# EAGLE design Explore Labs ESP8266 WiFi Internet of Things IoT Breakout (EAGLE 7.5.0)
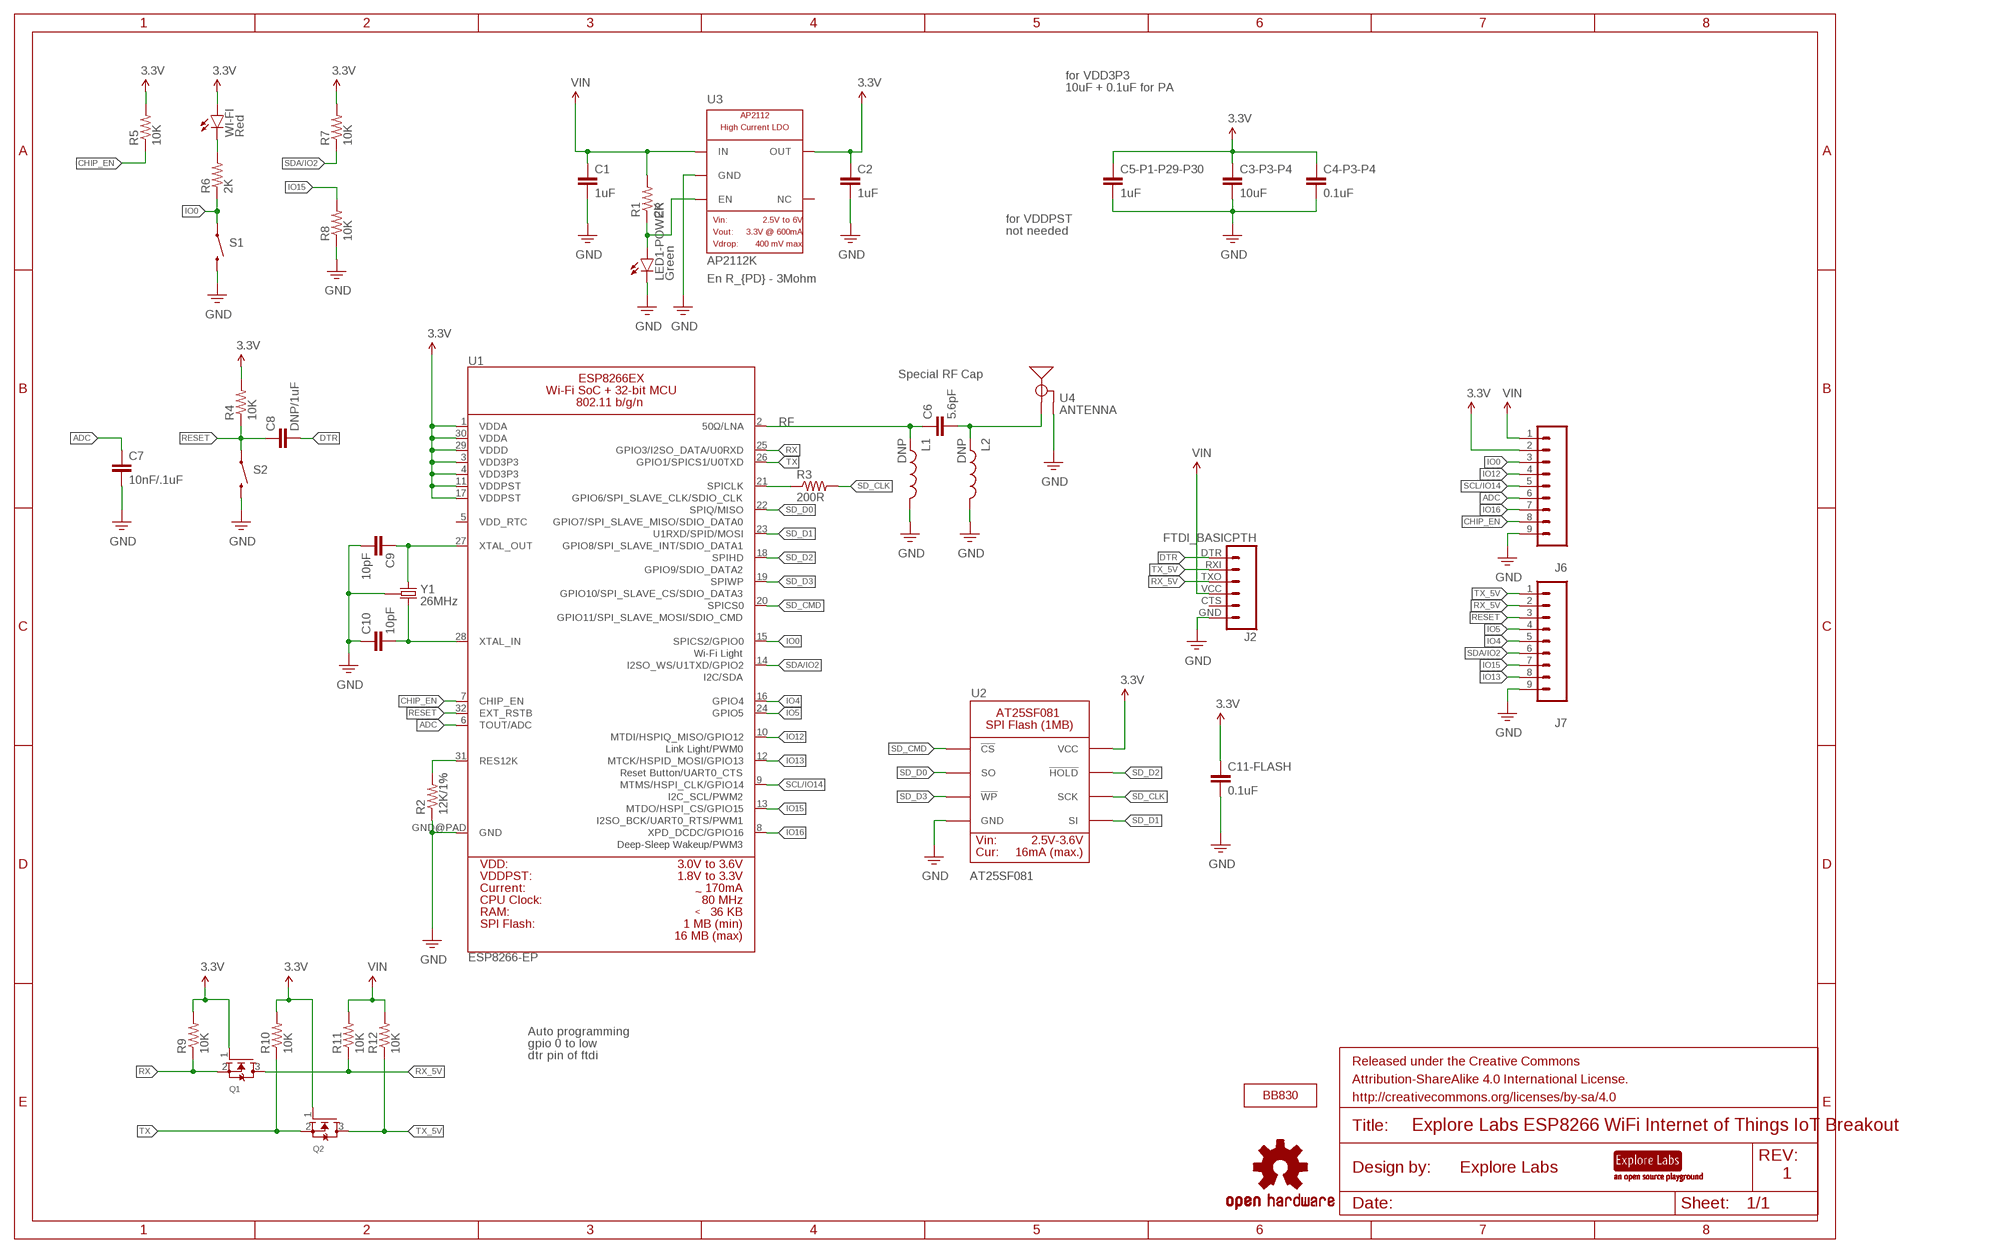
[diagram p0: schematic, sheet 1]

## Parts
C1  1uF  CAPACITOR-0402  [0402-CAP]
C2  1uF  CAPACITOR-0402  [0402-CAP]
C3-P3-P4  10uF  CAPACITOR  [0603-CAP]
C4-P3-P4  0.1uF  CAPACITOR-0402  [0402-CAP]
C5-P1-P29-P30  1uF  CAPACITOR-0402  [0402-CAP]
C6  5.6pF  CAPACITOR-0402  [0402-CAP]
C7  10nF/.1uF  CAPACITOR-0402  [0402-CAP]
C8  DNP/1uF  CAPACITOR-0402  [0402-CAP]
C9  10pF  CAPACITOR-0402  [0402-CAP]
C10  10pF  CAPACITOR-0402  [0402-CAP]
C11-FLASH  0.1uF  CAPACITOR-0402  [0402-CAP]
J2  FTDI_BASICPTH  [FTDI_BASIC]
J6  M09  [1X09]
J7  M09  [1X09]
L1  DNP  INDUCTOR  [0402-FERRITE]
L2  DNP  INDUCTOR  [0402-FERRITE]
LED1-POWER  Green  LED0603  [LED-0603]
LOGO1  OSHW-LOGOBOTTOM  [OSHW-LOGO-M-BOTTOM]
Q1  MOSFET-N  [SOT23]
Q2  MOSFET-N  [SOT23]
R1  2K  RESISTOR-0402  [0402-RES]
R2  12K/1%  RESISTOR-0402  [0402-RES]
R3  200R  RESISTOR-0402  [0402-RES]
R4  10K  RESISTOR-0402  [0402-RES]
R5  10K  RESISTOR-0402  [0402-RES]
R6  2K  RESISTOR-0402  [0402-RES]
R7  10K  RESISTOR-0402  [0402-RES]
R8  10K  RESISTOR-0402  [0402-RES]
R9  10K  RESISTOR-0402  [0402-RES]
R10  10K  RESISTOR-0402  [0402-RES]
R11  10K  RESISTOR-0402  [0402-RES]
R12  10K  RESISTOR-0402  [0402-RES]
S1  SWITCH-NO-MOM  [KXT-SWITCH]
S2  SWITCH-NO-MOM  [KXT-SWITCH]
U1  ESP8266-EP  [QFN32]
U2  AT25SF081  [SO08]
U3  AP2112K  [SOT23-LDO]
U4  ANTENNA  [ANTENNA-WROOM-02-INV]
U$3  26MHz  CRYSTAL-GROUNDED  [CRYSTAL-3225]
U$4  EXPLORE-LABS-LOGOBOTTOM  [EXLABS_LOGO_0.25]
U$7  BREADBOARD-830  [BREADBOARD-830]
WI-FI  Red  LED0603  [LED-0603]

## Nets
3.3V: C2.1 C3-P3-P4.1 C4-P3-P4.1 C5-P1-P29-P30.1 C11-FLASH.1 J6.2 Q1.1(G) Q2.1(G) R4.2 R5.2 R7.2 R9.2 R10.2 U1.1(VDDA) U1.3(VDD3P3) U1.4(VDD3P3) U1.11(VDDPST) U1.17(VDDPST) U1.29(VDDD) U1.30(VDDA) U2.8(VCC) U3.5(OUT) WI-FI.A
ADC: C7.1 J6.6 U1.6(TOUT/ADC)
CHIP_EN: J6.8 R5.1 U1.7(CHIP_EN)
DTR: C8.2 J2.DTR
GND: C1.2 C2.2 C3-P3-P4.2 C4-P3-P4.2 C5-P1-P29-P30.2 C7.2 C9.2 C10.1 C11-FLASH.2 J2.GND J6.9 J7.9 L1.2 L2.2 LED1-POWER.C R2.1 R8.1 S1.2 S2.2 U1.GND@PAD(GND) U2.4(GND) U3.2(GND) U4.GND U$3.2 U$3.4
IO0: J6.3 R6.1 S1.1 U1.15(SPICS2/GPIO0)
IO4: J7.5 U1.16(GPIO4)
IO5: J7.4 U1.24(GPIO5)
IO12: J6.4 U1.10(MTDI/HSPIQ_MISO/GPIO12)
IO13: J7.8 U1.12(MTCK/HSPID_MOSI/GPIO13)
IO15: J7.7 R8.2 U1.13(MTDO/HSPI_CS/GPIO15)
IO16: J6.7 U1.8(XPD_DCDC/GPIO16)
N$1: R3.1 U1.21(SPICLK)
N$2: R6.2 WI-FI.C
N$3: LED1-POWER.A R1.1 U3.3(EN)
N$6: C9.1 U1.27(XTAL_OUT) U$3.1
N$8: C10.2 U1.28(XTAL_IN) U$3.3
N$11: R2.2 U1.31(RES12K)
N$13: C6.2 L2.1 U4.SIG(SIGNAL)
RESET: C8.1 J7.3 R4.1 S2.1 U1.32(EXT_RSTB)
RF: C6.1 L1.1 U1.2(50Ω/LNA)
RX: Q1.2(S) R9.1 U1.25(GPIO3/I2SO_DATA/U0RXD)
RX_5V: J2.TXO J7.2 Q1.3(D) R11.1
SCL/IO14: J6.5 U1.9(MTMS/HSPI_CLK/GPIO14)
SD_CLK: R3.2 U2.6(SCK)
SD_CMD: U1.20(SPICS0) U2.1(!CS)
SD_D0: U1.22(SPIQ/MISO) U2.2(SO)
SD_D1: U1.23(U1RXD/SPID/MOSI) U2.5(SI)
SD_D2: U1.18(SPIHD) U2.7(!HOLD)
SD_D3: U1.19(SPIWP) U2.3(!WP)
SDA/IO2: J7.6 R7.1 U1.14(I2SO_WS/U1TXD/GPIO2)
TX: Q2.2(S) R10.1 U1.26(GPIO1/SPICS1/U0TXD)
TX_5V: J2.RXI J7.1 Q2.3(D) R12.1
VIN: C1.1 J2.VCC J6.1 R1.2 R11.2 R12.2 U3.1(IN)
Unconnected: J2.CTS U1.5(VDD_RTC) U3.4(NC)

## Notes on the sheet
- for VDD3P3
- 10uF + 0.1uF for PA
- for VDDPST
- not needed
- En R_{PD} - 3Mohm
- Special RF Cap
- Y1
- Auto programming
- gpio 0 to low
- dtr pin of ftdi
- 1

## Library data of the parts
C1 C2 C3-P3-P4 C4-P3-P4 C5-P1-P29-P30 C6-C10 C11-FLASH = Explore Labs EAGLE Library:CAPACITOR
J2 = SparkFun-Connectors:FTDI_BASIC: FTDI Basic header with labels
J6 J7 = SparkFun-Connectors:M09: Header 9 Standard 9-pin 0.1" header. Use with straight break away headers (SKU : PRT-00116), right angle break away headers (PRT-00553), swiss pins (PRT-00743), machine pins (PRT-00117), and female headers (PRT-00115).
L1 L2 = Explore Labs EAGLE Library:INDUCTOR: Inductors Basic Inductor/Choke - 0603 and 1206. Footprints are not proven and vary greatly between part numbers.
LED1-POWER WI-FI = SparkFun-LED:LED: LEDs Standard schematic elements and footprints for 5mm, 3mm, 1206, and 0603 sized LEDs. 5mm - Spark Fun Electronics SKU : COM-00529 (and others)
LOGO1 = Explore Labs EAGLE Library:OSHW-LOGO: Open Source Hardware Logo This logo indicates the piece of hardware it is found on incorporates a OSHW license and/or adheres to the definition of open source hardware found here: http://freedomdefined.org/OSHW
Q1 Q2 = Explore Labs EAGLE Library:MOSFET-N: 2N7002P 60 V, 360 mA N-channel Trench MOSFET. N-channel enhancement mode Field-Effect Transistor (FET) in a small SOT23 (TO-236AB) Surface-Mounted Device (SMD) plastic package using Trench MOSFET technology. VDS (drain-source voltage) = 60 V (max.) VGS (gate-source voltage) = -20 V to 20 V ID (drain current) = 360 mA RDSon (drain-source on-state resistance) = 1.6 ohm (max.) VGSth (gate-source threshold voltage) = 1.1 V (min.), 1.75 V (typ.), 2.4 V (max.)
R1-R12 = Explore Labs EAGLE Library:RESISTOR
S1 S2 = Explore Labs EAGLE Library:SWITCH-NO-MOM: Normally Open switches - Pushbuttons (for reset), etc.
U1 = Explore Labs EAGLE Library:ESP8266: ESP8266EX Datasheet Version 4.4 Espressif Systems IOT Team http://bbs.espressif.com/ ESP8266EX offers a complete and self-contained WiFi networking solution; it can be used to host the application or to offload WiFi networking functions from another application processor. When ESP8266EX hosts the application, it boots up directly from an external flash. In has integrated cache to improve the performance of the system in such applications. Alternately, serving as a WiFi adapter, wireless internet access can be added to any micro controller- based design with simple connectivity (SPI/SDIO or I2C/UART interface). ESP8266EX also integrates an enhanced version of Tensilica’s L106 Diamond series 32-bit processor, with on-chip SRAM, besides the WiFi functionalities. Features: 802.11 b/g/n Integrated low power 32-bit MCU Integrated 10-bit ADC Integrated TCP/IP protocol stack Integrated TR switch, balun, LNA, power amplifier and matching network Integrated PLL, regulators, and power management units Supports antenna diversity WiFi 2.4 GHz, support WPA/WPA2 Deep sleep power < 10uA, Power down leakage current < 5uA Wake up and transmit packets in < 2ms Standby power consumption of < 1.0mW (DTIM3)
U2 = Explore Labs EAGLE Library:AT25SF081: AT25SF081 8-Mbit, 2.5V Minimum SPI Serial Flash Memory with Dual-I/O and Quad-IO Support Features: Single 2.5V - 3.6V Supply Serial Peripheral Interface (SPI) Compatible Supports SPI Modes 0 and 3 Supports Dual and Quad Output Read 104MHz Maximum Operating Frequency Low Power Dissipation: 2μA Deep Power-Down Current (Typical) 10μA Standby current (Typical) 4mA Active Read Current (Typical)
U3 = Explore Labs EAGLE Library:AP2112K
U4 = Explore Labs EAGLE Library:ANTENNA: 2.4 GHz Inverted F Antenna as shown in Design Note DN0007 (swru120b) by Audun Andersen of Texas Instruments. The antenna has an omni directional radiation pattern in the plane of the PCB. Summary of the Properties of the IFA: Gain in XY Plane: 1.1 dB Gain in XZ Plane: 3.3 dB Gain in YZ Plane: 1.6 dB Reflection: < -15 dB Antenna Size: 25.7 x 7.5 mm Note: No external matching components are needed since the impedance of the Inverted F Antenna is matched directly to 50 ohm. Note: PCB with 1 mm thickness is taken as reference width in design note. Note: Width of Feed Point: 0.46 mm.
U$3 = Explore Labs EAGLE Library:CRYSTAL-GROUNDED
U$4 = Explore Labs EAGLE Library:EXPLORE-LABS-LOGO
U$7 = Explore Labs EAGLE Library:BREADBOARD-830

## Board
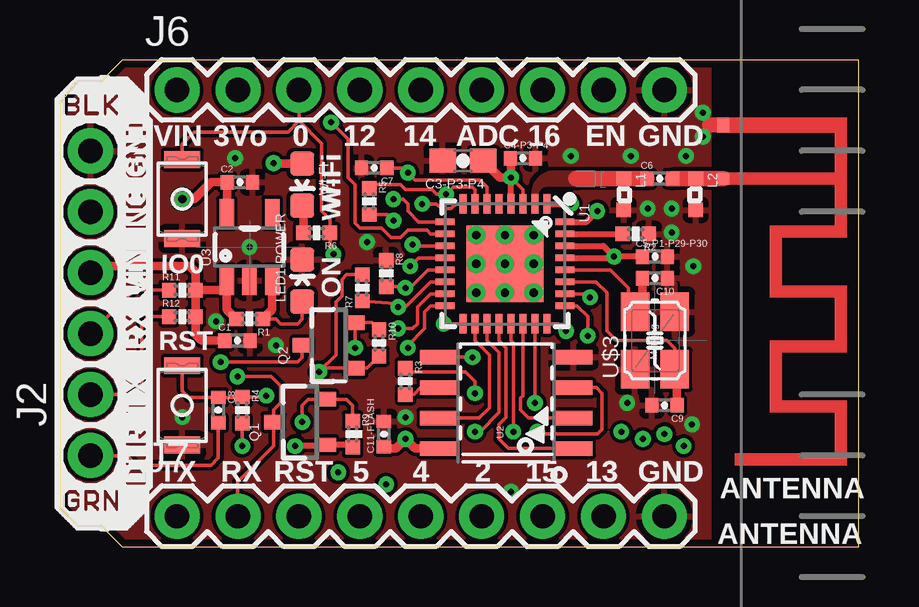
[diagram p1: board, top side]
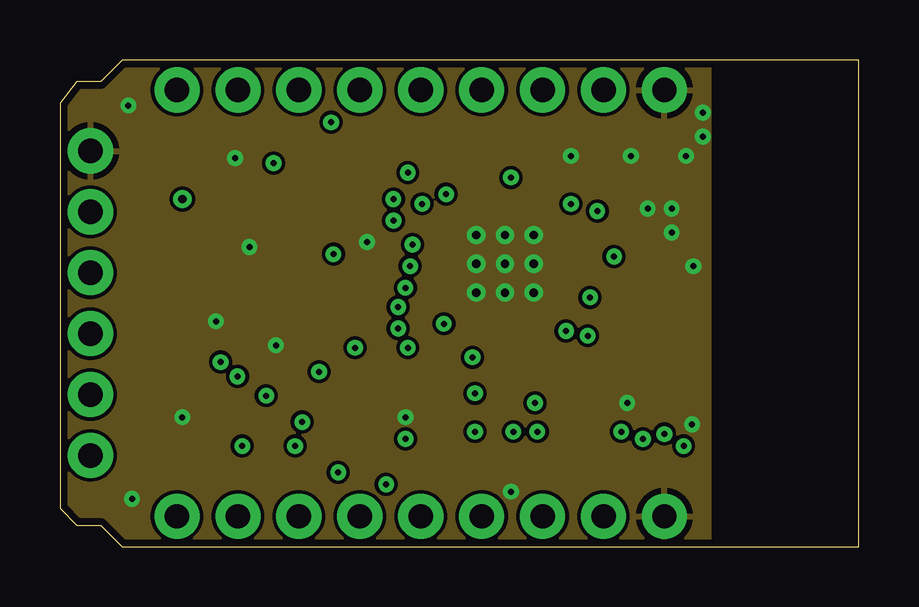
[diagram p2: board, inner layer Route2]
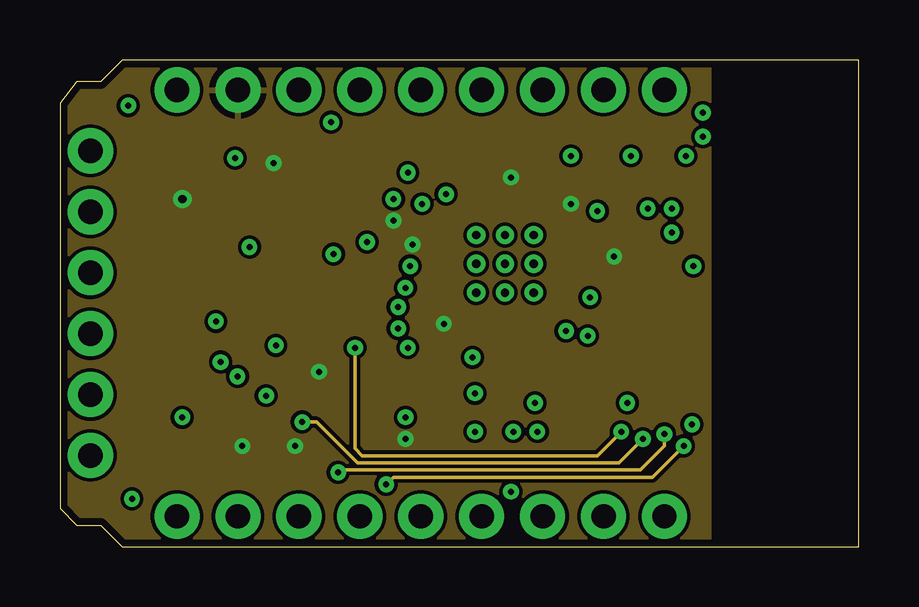
[diagram p3: board, inner layer Route15]
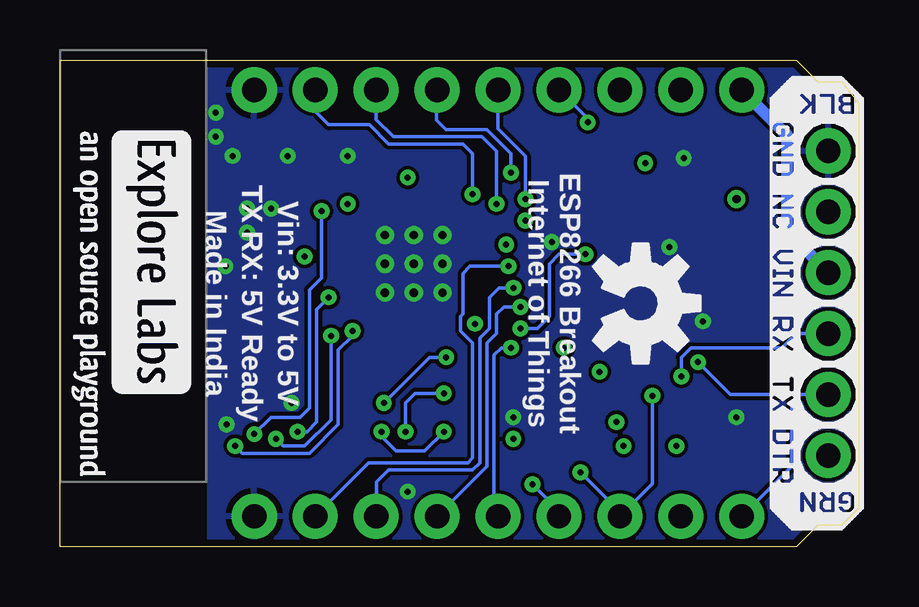
[diagram p4: board, bottom side, seen from below]

Size 33.3 x 20.3 mm. Coordinates in mm from the lower left corner, seen from the top.
Outline: 2.6,0 33.3,0 33.3,20.3 2.6,20.3 1.7,19.4 0.7,19.4 0,18.5 0,1.6 0.7,0.9 1.7,0.9 2.6,0
Copper layers (1+2*15+16): Top 0.035mm / dielectric 0.35mm / Route2 0.035mm / dielectric 0.71mm / Route15 0.035mm / dielectric 0.35mm / Bottom 0.035mm
Design rules "Explore Labs 4 Layer - Standard Stack-Up *": minimum track width 0.15mm, minimum drill 0.15mm, track to track 0.15mm, track to pad 0.15mm, pad to pad 0.15mm, via to via 0.15mm, smd to smd 0.15mm, copper to edge 0.3mm, drill to drill 0.2mm, minimum pad ring 10mil, minimum via ring 8mil, stop-mask expansion 4mil, vias tented up to drill 0.35mm, thermal gap 10mil

### Footprints (pad centres in the part's own frame; a part is rotated, then mirrored left to right if it is on the bottom)
0402-CAP = smd 0.55 x 0.6: 1 -0.525,0; 2 0.525,0
0603-CAP = smd 1.1 x 1: 1 -0.85,0; 2 0.85,0
FTDI_BASIC = drill 1.016 pad 1.88: CTS 10.16,0; DTR 0,0; GND 12.7,0; RXI 2.54,0; TXO 5.08,0; VCC 7.62,0
1X09 = drill 1.016 pad 1.88: 1 0,0; 2 2.54,0; 3 5.08,0; 4 7.62,0; 5 10.16,0; 6 12.7,0; 7 15.24,0; 8 17.78,0; 9 20.32,0
0402-FERRITE = smd 0.6 x 0.6: 1 -0.65,0; 2 0.65,0
LED-0603 = smd 1 x 1: A 0,-0.877; C 0,0.877
SOT23 = smd 0.6 x 0.8: 1 -0.95,-1; 2 0.95,-1; 3 0,1.2
0402-RES = smd 0.6 x 0.6: 1 -0.55,0; 2 0.55,0
KXT-SWITCH = smd 0.7 x 1.5: 1 -1.65,0; 2 1.65,0
QFN32 = smd 0.8 x 0.285: 1 -2.5,1.75; 2 -2.5,1.25; 3 -2.5,0.75; 4 -2.5,0.25; 5 -2.5,-0.25; 6 -2.5,-0.75; 7 -2.5,-1.25; 8 -2.5,-1.75; 17 2.5,-1.75; 18 2.5,-1.25; 19 2.5,-0.75; 20 2.5,-0.25; 21 2.5,0.25; 22 2.5,0.75; 23 2.5,1.25; 24 2.5,1.75 | smd 0.285 x 0.8: 9 -1.75,-2.5; 10 -1.25,-2.5; 11 -0.75,-2.5; 12 -0.25,-2.5; 13 0.25,-2.5; 14 0.75,-2.5; 15 1.25,-2.5; 16 1.75,-2.5; 25 1.75,2.5; 26 1.25,2.5; 27 0.75,2.5; 28 0.25,2.5; 29 -0.25,2.5; 30 -0.75,2.5; 31 -1.25,2.5; 32 -1.75,2.5 | smd 3.2 x 3.2: GND@PAD 0,0
SO08 = smd 0.6 x 1.6: 1 -1.905,-2.8; 2 -0.635,-2.8; 3 0.635,-2.8; 4 1.905,-2.8; 5 1.905,2.8; 6 0.635,2.8; 7 -0.635,2.8; 8 -1.905,2.8
SOT23-LDO = smd 1.2 x 0.6: 1 -1.4,0.95; 2 -1.4,0; 3 -1.4,-0.95; 4 1.4,-0.95; 5 1.4,0.95
ANTENNA-WROOM-02-INV = smd 0.627 x 0.5: GND -1.986,0.25 | smd 0.5 x 0.5: SIG 0.25,0.25
CRYSTAL-3225 = smd 1.6 x 1.2: 1 -1.2,-0.825; 2 1.2,-0.825; 3 1.2,0.825; 4 -1.2,0.825

### Placement (x,y rotation side)
C1  7.4,8.6 0 top
C2  7.5,15.2 0 top
C3-P3-P4  16.8,16.1 180 top
C4-P3-P4  19.3,16.2 0 top
C5-P1-P29-P30  24.8,12.1 0 top
C6  25,15.35 0 top
C7  13.1,15.8 180 top
C8  6.6,5.7 270 top
C9  25.2,5.9 180 top
C10  24.8,11.2 180 top
C11-FLASH  13.5,4.7 90 top
J2  1.27,3.81 90 top
J6  4.88,19.05 0 top
J7  4.88,1.27 0 top
L1  23.5,14.7 270 top
L2  26.5,14.7 270 top
LED1-POWER  10.1,11.1 0 top
LOGO1  9.1,10.15 90 top
Q1  10.1,5.2 90 top
Q2  11.3,8.4 90 top
R1  7.9,9.5 180 top
R2  24,13.05 180 top
R3  14.4,6.9 270 top
R4  7.6,5.7 270 top
R5  12.9,14.4 270 top
R6  10.7,13.1 180 top
R7  12.6,10.8 90 top
R8  13.6,11.4 270 top
R9  12.2,4.7 270 top
R10  13.3,8.5 270 top
R11  5.1,10.7 0 top
R12  5.1,9.6 0 top
S1  5.1,14.5 270 top
S2  5.1,5.9 270 top
U1  18.55,11.8 270 top
U2  18.6,6 90 top
U3  7.9,12.5 90 top
U4  27.4,15.6 270 top
U$1  [ESP-FTDI-BOTTOM]  1.3,10.2 0 top
U$2  [ESP-FTDI]  1.3,10.1 0 top
U$3  24.8,8.6 90 top
U$4  32.9,17.35 270 bottom
U$7  28.38,37.47 180 top  (outside the outline)
WI-FI  10.1,15.1 180 top

### Tracks (layer width: path | path; a pad name or v marks a point on that pad's centre or on a via)
3.3V  (via drill 0.25, 0.35)
  Top 0.15: U1.3 19.3,14.9 v18.8,15.4 | U1.11 14.75,12.55 v14.7,12.6 | U1.17 v16,9.3 | v13.9,13.6 13.65,13.85 R5.2 | R10.2 12.8,7.45 Q2.1 10.95,7.45 v10.8,7.3 11.5,8 11.5,10.2 11.75,10.45 11.75,11.15 11.95,11.35 R7.2 | R4.2 7.6,4.4 v7.6,4.2
  Top 0.25: U1.1 v21.3,14.3 | C5-P1-P29-P30.1 v23.1,12.1 | U1.30 22.65,12.55 v23.1,12.1 | U1.29 23.05,12.05 v23.1,12.1 | U1.4 v18.8,15.4 | R5.2 | 11.2,4.15 11.15,4.2 v9.8,4.2 | R9.2 12.1,4.25 Q1.1
  Top 0.35: 13.45,4.1 14,4.1 v14.4,4.5 14.81,4.09 U2.8 | 13.45,4.1 C11-FLASH.1 | C3-P3-P4.1 18.35,15.4 v18.8,15.4 18.8,16.17 C4-P3-P4.1 | WI-FI.A 9.03,15.98 v8.9,16 | 13.45,4.1 13.4,4.15 | 11.2,4.15 Q1.1 | U3.5 6.97,13.93 C2.1 6.3,15.2 5.6,14.5 v5.1,14.5
  pour Route15: -1.2,25.8 27.1,25.8 27.1,-0.2 -1.2,-0.2
ADC  (via drill 0.25)
  Top 0.15: U1.6 17.8,15 17.5,15.3 14.8,15.3 v14.5,15.6 14.3,15.8 C7.1
  Bottom 0.15: v14.5,15.6 14.5,16.4 15.5,17.4 17.2,17.4 17.6,17.8 17.6,19.03 J6.6
CHIP_EN  (via drill 0.25)
  Top 0.15: U1.7 17.3,14.9 17.2,15 16.4,15 v16.1,14.7 15.7,14.7 15.5,14.9 14.4,14.9 14.2,15.1 13.05,15.1 R5.1
  Bottom 0.15: v16.1,14.7 16.1,16.4 16.5,16.8 19.6,16.8 20.4,17.6 22.1,17.6 22.66,18.16 J6.8
DTR
  Top 0.15: C8.2 6.6,3.7 6.3,3.4 3.2,3.4 2.8,3.8 J2.DTR
GND  (via drill 0.25, 0.35)
  Top 0.627: U4.GND 27.09,17.59
  other vias: 21.3,16.3 26.4,11.7 24.5,14.1 18.8,2.3 14.4,5.4 26.1,16.3 23.8,16.3 23.65,6 26.35,5.1 2.85,18.4 25.5,14.1 25.5,13.1 26.8,18.1 26.8,17.1 7.9,12.5 17.35,13 19.75,13 18.55,11.8 19.75,10.6 17.35,10.6 19.75,11.8 17.35,11.8 18.55,13 18.55,10.6 9,8.4 12.8,12.7 7.3,16.2 3,2 5.1,5.4 6.5,9.4
  pour Top (rank 3): -1.2,29.8 27.1,29.8 27.1,-0.2 -1.2,-0.2
  pour Bottom: -1.2,23.8 27.1,23.8 27.1,-0.2 -1.2,-0.2
  pour Route2: -1.2,27.8 27.1,27.8 27.1,-0.2 -1.2,-0.2
IO0  (via drill 0.25)
  Top 0.15: U1.15 15.45,10.55 14.9,10 14.9,9.3 14.7,9.1 v14.1,9.1 | J6.3 9.96,17.76 | 9.96,17.76 9.5,17.3 5.6,17.3 5.1,16.8 S1.1 | 9.96,17.76 10.9,16.82 10.9,14 11.25,13.65 R6.1 11.25,12.35 v11.4,12.2
  Bottom 0.15: v14.1,9.1 13.4,9.1 12.9,9.6 12.9,11.8 12.5,12.2 v11.4,12.2
IO4  (via drill 0.25)
  Top 0.15: U1.16 15.45,10.05 15.2,9.8 15.2,9.1 14.5,8.4 v14.5,8.3
  Bottom 0.15: v14.5,8.3 14.9,8.3 15.2,8 15.2,1.43 J7.5
IO5  (via drill 0.25)
  Top 0.15: U1.24 20.8,9.3 v21.1,9
  Route15 0.15: v13.6,2.6 13.9,2.9 24.7,2.9 v26,4.2
  Bottom 0.15: v21.1,9 21.1,8.8 21.7,8.2 21.7,5.1 22.9,3.9 25.7,3.9 v26,4.2 | v13.6,2.6 12.5,1.5 J7.4
IO12  (via drill 0.25)
  Top 0.15: U1.10 15.45,13.05 15.3,13.2 14.5,13.2 14.2,12.9 13.8,12.9 13.4,13.3 12.5,13.3 12.3,13.5 12.3,15.1 12,15.4 12,17 v11.3,17.7
  Bottom 0.15: J6.4 11.3,17.85 v11.3,17.7
IO13  (via drill 0.25)
  Top 0.15: U1.12 14.95,12.05 v14.6,11.7
  Bottom 0.15: v14.6,11.7 16.2,11.7 16.5,11.4 16.5,9.7 16.6,9.6 16.6,9 16.1,8.5 16.1,3.7 16.3,3.5 20.43,3.5 J7.8
IO15  (via drill 0.25)
  Top 0.15: U1.13 15.35,11.55 14.6,10.8 v14.4,10.8 14.35,10.85 R8.2
  Bottom 0.15: v14.4,10.8 15,10.8 15.4,10.4 15.4,9.1 15.8,8.7 15.8,3.5 16.1,3.2 19.6,3.2 20.1,2.7 20.1,1.39 20.12,1.37 J7.7
IO16  (via drill 0.25)
  Top 0.15: U1.8 16.5,14.3 16.3,14.1 15.9,14.1 15.7,14.3 v15.1,14.3
  Bottom 0.15: v15.1,14.3 15.1,16.5 15.7,17.1 19.4,17.1 20.12,17.82 J6.7
N$1  (via drill 0.25)
  Top 0.15: U1.21 18.8,8.6 18.9,8.5 v18.9,4.8 | R3.1 14.55,7.3 16.9,7.3 17.3,6.9 v17.3,6.4
  Bottom 0.15: v17.3,6.4 18.5,6.4 18.9,6 v18.9,4.8
N$2
  Top 0.35: WI-FI.C 10.15,14.17 R6.2
N$3
  Top 0.15: R1.1 9,9.5 9.2,9.3 9.9,9.3 10.1,9.5 LED1-POWER.A
  Top 0.35: U3.3 8.85,9.9 R1.1
N$6
  Top 0.15: U1.27 22.35,11.05 22.8,10.6 22.8,9 23.2,8.6 25.3,8.6 25.62,8.28 U$3.1 | 25.65,7.37 U$3.1 | 25.6,7.42 U$3.1
  Top 0.25: 25.73,7.3 U$3.1
  Top 0.35: C9.1 25.73,7.3 U$3.1
  Top 0.5: 25.75,7.27 U$3.1
N$8
  Top 0.15: U1.28 22.95,11.55 23.7,10.8 23.7,10.07 U$3.3 23.7,10.07
  Top 0.25: 24.28,10.11 U$3.3
  Top 0.35: C10.2 24.28,10.1 U$3.3
N$11
  Top 0.25: U1.31 R2.2
N$13
  Top 0.65: U4.SIG L2.1 C6.2
RESET  (via drill 0.25)
  Top 0.15: S2.1 5.1,6.5 5.38,6.22 C8.1 7.58,6.22 R4.1 8.55,6.25 v8.6,6.3
  Top 0.25: U1.32 21.95,13.55 v22.4,14
  Route15 0.15: v25.2,4.7 25.2,4.2 24.2,3.2 11.8,3.2 11.7,3.1 v11.6,3.1
  Bottom 0.15: v22.4,14 22.4,11.2 22.9,10.7 22.9,5.8 23.3,5.4 24.5,5.4 v25.2,4.7 | v8.6,6.3 8.6,2.63 J7.3 9.96,1.46 v11.6,3.1
RF
  Top 0.65: 21.5,15.35 L1.1 C6.1
  pour Top (rank 2, no thermals): 19.66,14.7 arc-83 20.44,15.68 21.5,15.68 21.5,15.03 20.38,15.03 arc82 19.95,14.7
RX  (via drill 0.25)
  Top 0.15: U1.25 21.55,10.05 22,9.6 v22,8.8 | R9.1 12.2,5.9 11.95,6.15 Q1.2 10.35,6.15 10.1,5.9 v10.1,5.2
  Route15 0.15: v24.3,4.5 23.3,3.5 12.4,3.5 10.7,5.2 v10.1,5.2
  Bottom 0.15: v22,8.8 22,5.3 23.1,4.2 24,4.2 v24.3,4.5
RX_5V  (via drill 0.25)
  Top 0.15: R11.1 3.08,10.7 J2.TXO | Q1.3 | Q1.3 8.9,4.2 7.4,2.7 7.4,1.29 J7.2 | Q1.3 8.9,5.7 9.2,6 9.2,6.7 8.8,7.1 v7.4,7.1
  Bottom 0.15: J2.TXO 2.61,8.89 3.2,8.3 7,8.3 7.4,7.9 v7.4,7.1
SCL/IO14  (via drill 0.25)
  Top 0.15: v13.9,14.5 14.3,14.5 14.5,14.3 14.5,14 14.95,13.55 U1.9
  Bottom 0.15: v13.9,14.5 13.9,16.3 15.04,17.44 J6.5
SD_CLK
  Top 0.15: R3.2 14.75,6.35 15.04,6.63 U2.6
SD_CMD
  Top 0.15: U1.20 18.3,8.6 18.6,8.3 18.6,5.4 18.3,5.1 18.3,4.5 18.7,4.1 20.8,4.1 | 20.8,4.1 21.26,4.1 | U2.1 20.8,4.09 20.8,4.1
SD_D0
  Top 0.15: U1.22 19.3,6.3 19.2,6.2 19.2,5.7 19.54,5.37 U2.2
SD_D1  (via drill 0.25)
  Top 0.15: U1.23 19.8,8.5 19.8,6.7 19.8,6.4 v19.8,6 | U2.5 17.3,7.91 v17.2,7.9
  Bottom 0.15: v19.8,6 17.9,7.9 v17.2,7.9
SD_D2
  Top 0.15: U1.18 17.3,8.6 17.9,8 17.9,5.8 17.46,5.37 U2.7
SD_D3  (via drill 0.25)
  Top 0.15: U1.19 17.8,8.6 18.3,8.1 18.3,5.6 17.5,4.8 v17.3,4.8 | v19.9,4.8 20,4.7 22.4,4.7 22.6,4.9 22.6,6.4 22.36,6.63 U2.3
  Bottom 0.15: v17.3,4.8 18.1,4 19.3,4 19.9,4.6 v19.9,4.8
SDA/IO2  (via drill 0.25)
  Top 0.15: U1.14 15.45,11.05 14.4,10 v14.1,10 13.95,10.15 R7.1
  Bottom 0.15: v14.1,10 14.8,10 15.1,9.7 15.1,8.9 15.5,8.5 15.5,3.35 J7.6
TX  (via drill 0.25)
  Top 0.15: U1.26 21.95,10.55 v22.1,10.4 | v12.3,8.3 Q2.2 13,9.35 R10.1
  Route15 0.15: v23.4,4.8 22.4,3.8 12.6,3.8 12.3,4.1 v12.3,8.3
  Bottom 0.15: v22.1,10.4 22.6,9.9 22.6,5.2 23,4.8 v23.4,4.8
TX_5V  (via drill 0.25)
  Top 0.15: R12.1 3.7,9.6 3.4,9.3 3.4,6.8 2.95,6.35 J2.RXI | Q2.3 10.1,7.9 9.9,7.7 v6.7,7.7
  Bottom 0.15: v6.7,7.7 5.35,6.35 2.5,6.35 | 2.5,6.35 J2.RXI | J7.1 2.8,3.35 2.8,6.05 2.5,6.35
VIN
  Top 0.35: R1.2 6.95,9.9 6.95,10.7 | 6.95,10.7 U3.1 | C1.1 5.9,8.6 5.65,8.85 R12.2 R11.2 | R11.2 5.65,11.45 5.4,11.7 1.54,11.7 J2.VCC | R11.2 6.95,10.7
  Bottom 0.5: J6.1 3,17.17 3,13.15 J2.VCC

### Text on the board
tPlace: VIN | 3Vo | 0 | 12 | 14 | ADC | 16 | EN | GND | GND | Wi-Fi | NC | IO0 | VIN | ON | RX | RST | TX | DTR | TX | RX | RST | 5 | 4 | 2 | 15 | 13 | GND | ANTENNA
_tsilk: VIN | 3Vo | 0 | 12 | 14 | ADC | 16 | EN | GND | WiFi | IO0 | ON | RST | TX | RX | RST | 5 | 4 | 2 | 15 | 13 | GND | ANTENNA
_bsilk: ESP8266 Breakout / Internet of Things | Vin: 3.3V to 5V | TX RX: 5V Ready | Made in India